# Altium project PCB_Project1.PrjPCB
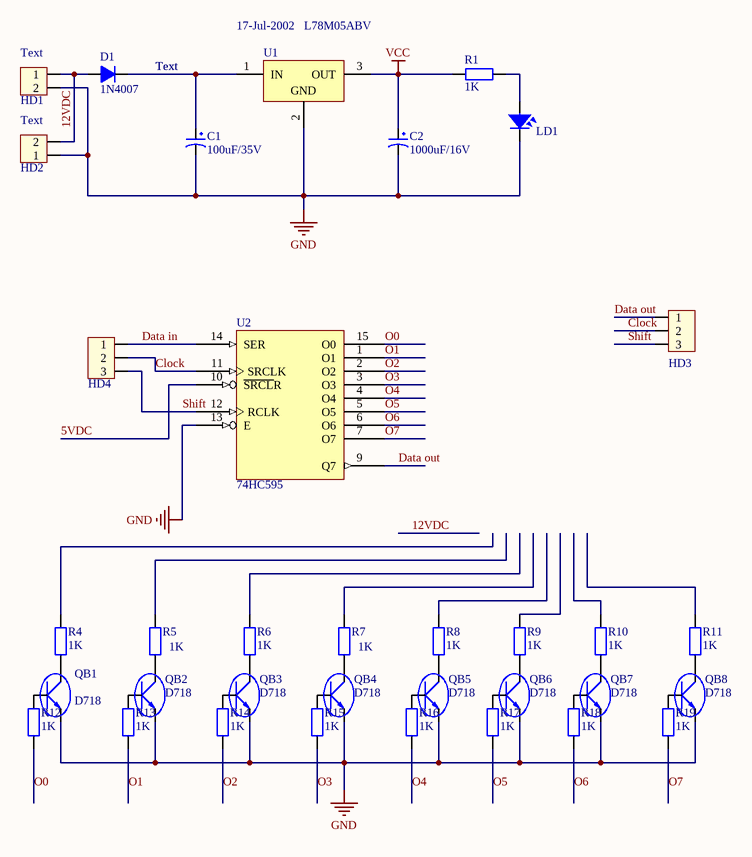
[diagram p0: project1.SchDoc]
1 sheet, 35 parts. Net scope: global (net labels, ports and power ports of the same name join across sheets).
Board file: project1.PcbDoc

## Sheet project1.SchDoc
size A

### Parts
C1  100uF/35V  [6-0805_N]
C2  1000uF/16V  [6-0805_N]
D1  1N4007  [DIODE_SMC]
HD1  Header 2  [JP2]  (value not drawn)
HD2  Header 2  [JP2]  (value not drawn)
HD3  Header 3  [JP3]  (value not drawn)
HD4  Header 3  [JP3]  (value not drawn)
LD1  LED  [6-0805_N]  (value not drawn)
QB1  D718  [SOT223-4N]
QB2  D718  [SOT223-4N]
QB3  D718  [SOT223-4N]
QB4  D718  [SOT223-4N]
QB5  D718  [SOT223-4N]
QB6  D718  [SOT223-4N]
QB7  D718  [SOT223-4N]
QB8  D718  [SOT223-4N]
R1  1K  [6-0805_N]
R4  1K  [6-0805_N]
R5  1K  [6-0805_N]
R6  1K  [6-0805_N]
R7  1K  [6-0805_N]
R8  1K  [6-0805_N]
R9  1K  [6-0805_N]
R10  1K  [6-0805_N]
R11  1K  [6-0805_N]
R12  1K  [6-0805_N]
R13  1K  [6-0805_N]
R14  1K  [6-0805_N]
R15  1K  [6-0805_N]
R16  1K  [6-0805_N]
R17  1K  [6-0805_N]
R18  1K  [6-0805_N]
R19  1K  [6-0805_N]
U1  L78M05ABV  LatestRevisionDate: 17-Jul-2002  [SOT89N]
U2  74HC595  [so16]

### Nets
GND: C1.2 C2.2 HD1.2 HD2.1 LD1.2 QB1.3(E) QB2.3(E) QB3.3(E) QB4.3(E) QB5.3(E) QB6.3(E) QB7.3(E) QB8.3(E) U1.2(GND) U2.8(GND) U2.13(E)
VCC: C2.1 R1.2 U1.3(OUT) U2.16(VCC)
5VDC: U2.10(~{SRCL}R)
12VDC: D1.1(A) HD1.1 HD2.2
Clock: HD3.2 HD4.2 U2.11(SRCLK)
Data in: HD4.1 U2.14(SER)
Data out: HD3.1 U2.9(Q7)
O0: R12.1 U2.15(O0)
O1: R13.1 U2.1(O1)
O2: R14.1 U2.2(O2)
O3: R15.1 U2.3(O3)
O4: R16.1 U2.4(O4)
O5: R17.1 U2.5(O5)
O6: R18.1 U2.6(O6)
O7: R19.1 U2.7(O7)
Shift: HD3.3 HD4.3 U2.12(RCLK)
NetC1_1: C1.1 D1.2(K) U1.1(IN)
NetLD1_1: LD1.1 R1.1
NetQB1_1: QB1.1(B) R12.2
NetQB1_2: QB1.2(C) R4.1
NetQB2_1: QB2.1(B) R13.2
NetQB2_2: QB2.2(C) R5.1
NetQB3_1: QB3.1(B) R14.2
NetQB3_2: QB3.2(C) R6.1
NetQB4_1: QB4.1(B) R15.2
NetQB4_2: QB4.2(C) R7.1
NetQB5_1: QB5.1(B) R16.2
NetQB5_2: QB5.2(C) R8.1
NetQB6_1: QB6.1(B) R17.2
NetQB6_2: QB6.2(C) R9.1
NetQB7_1: QB7.1(B) R18.2
NetQB7_2: QB7.2(C) R10.1
NetQB8_1: QB8.1(B) R19.2
NetQB8_2: QB8.2(C) R11.1

Not connected (* = marked no-connect by the designer): R4 2; R5 2; R6 2; R7 2; R8 2; R9 2; R10 2; R11 2

### Notes on the sheet
- (near HD1) Text
- (near HD2) Text
- (near D1) Text

### Library data of the parts
C1 = CP3: Cap 100uF/35V - 470uF/16V; Value: 100uF/35V/50V; Description 1: 1000uF/6,3V - 470uF/16V - 330uF - 25V; Description 2: 220uF/35V - 100uF/50V - 63V - 4,7uF/200V; Description 3: 22uF => 33uF100V - 3,3uF => 4,7uF/250V; Description 4: 2,2uF =>3,3uF/350 - 2,2uF/400V - 1uF/450V
C2 = CP4: Cap 1000uF/16V - 220uF/50V; Description 5: 4,7uF>10uF/250V_3,3uF>10uF/400V - 2,2uF>4,7uF/450V; Description 1: 2200uF-3300uF/6,3V - 1000uF-2200uF/10V; Description 2: 1000uF/16V - 470uF => 1000uF/25V - 100uF/100V; Description 3: 330uF>470uF/35V_220uF>470uF/50V_10uF>22uF/250V; Description 4: 220uF => 330uF/63V - 10uF =>33uF/160 - 200V; Value: 1000uF/16V
D1 = D1A: Diode 1A; Value: 1N4007
HD1 HD2 = Hed 2: Header 2 (Green); Value: Header 2
HD3 HD4 = Hed 3: Header 3 (Green); Value: Header 3
LD1 = LED: LED Single colour Green and Red; Value: LED 3 ly Single Colour
QB1-QB8 = D718: Transistor Power Supply; Value: D718
R1 R4-R19 = R1/4W: Resistor 1/4W; Value: R1/4W - 1K
U1 = L78M05ABV: Precision 500mA Regulator; Note: Tab is connected to pin 3 (GND).; Published: 24-Aug-2001; LatestRevisionNote: Re-released for DXP Platform.; DatasheetVersion: Mar-1997; PackageReference: TO220V; Publisher: Altium Limited; PackageDescription: TO, Thru-Hole, Vertical, Heatsink Mounted; 3 In-Line Leads; Pitch 2.54 mm; Pin sequence 1, 3, 2; ComponentLink1Description: Manufacturer Link; ComponentLink1URL: http://www.st.com/; ComponentLink2Description: Datasheet; ComponentLink2URL: http://www.st.com/stonline/products/literature/ds/2147/l78m05ab.pdf